# EAGLE design ee192 (EAGLE 7.0.0)
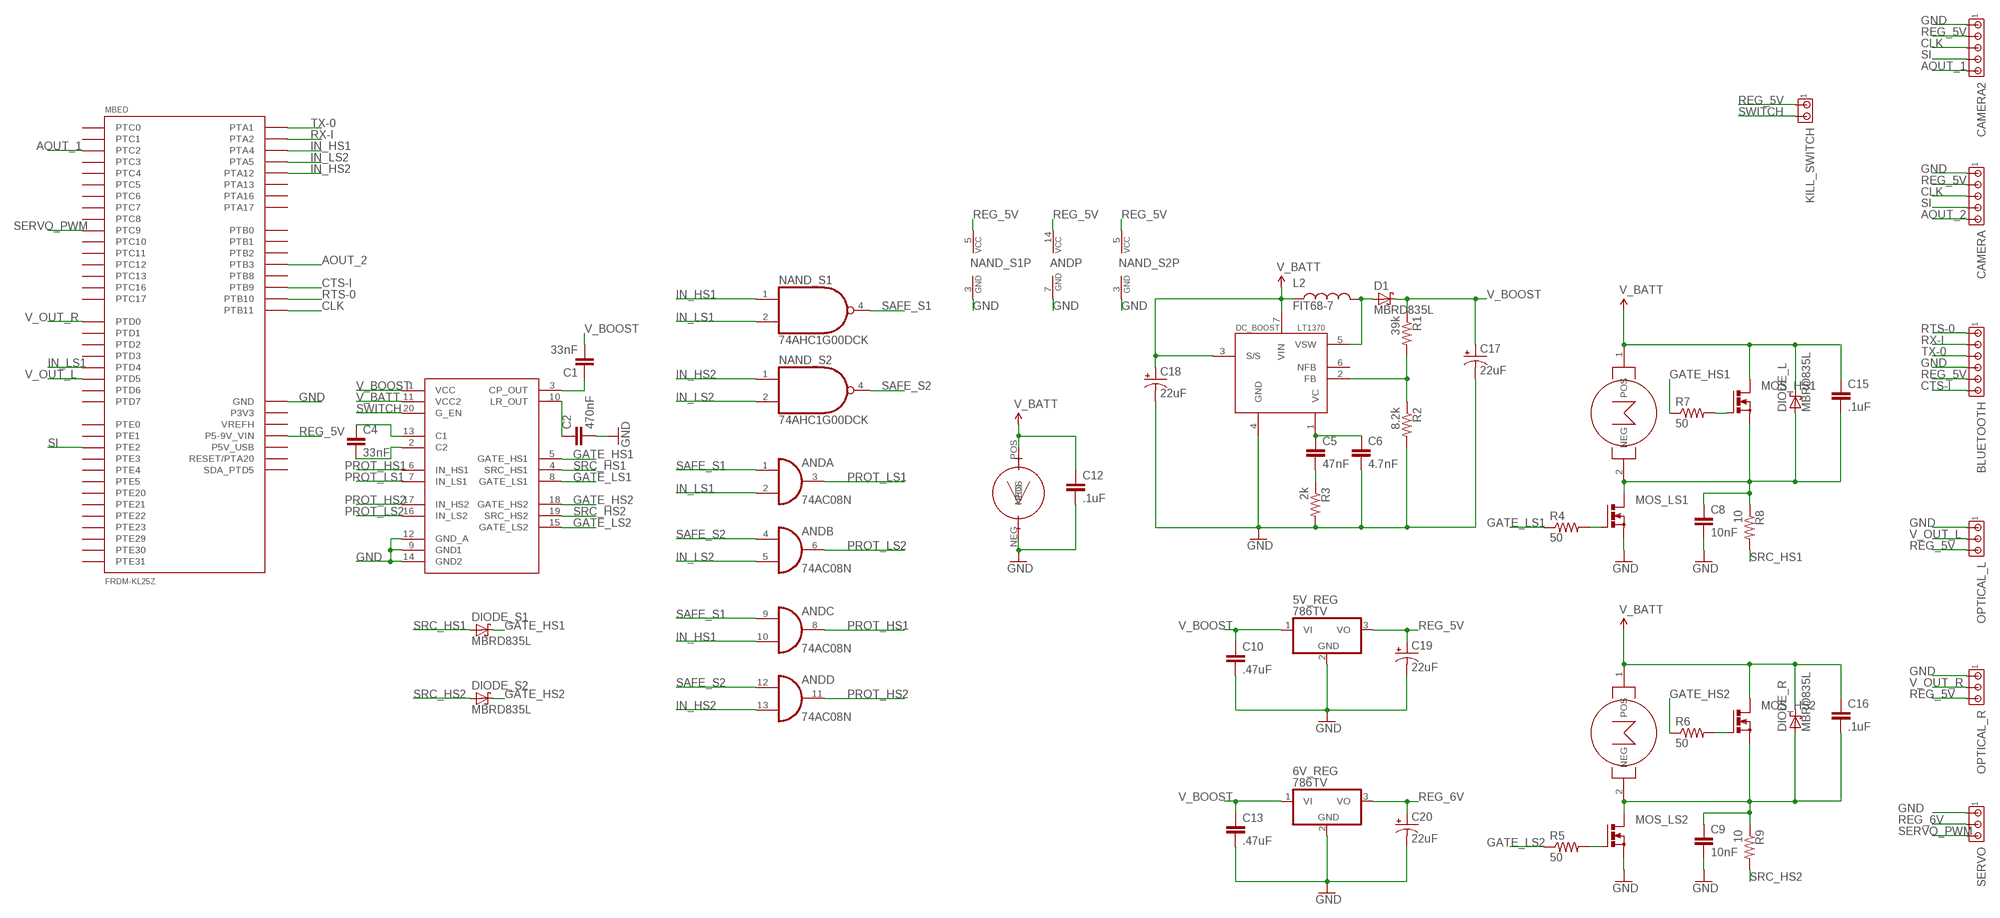
[diagram p0: schematic, sheet 1]

## Parts
5V_REG  786TV  [TO220V]
6V_REG  786TV  [TO220V]
AND  74AC08N  [DIL14]
BATTERY  BATT  [BATT]
BLUETOOTH  MTA06-100  [10X06MTA]
C1  33nF  CAP0805  [0805]
C2  470nF  CAP0805  [0805]
C4  33nF  CAP0805  [0805]
C5  47nF  CAP0805  [0805]
C6  4.7nF  CAP0805  [0805]
C8  10nF  CAP0805  [0805]
C9  10nF  CAP0805  [0805]
C10  .47uF  CAP0805  [0805]
C12  .1uF  CAP0805  [0805]
C13  .47uF  CAP0805  [0805]
C15  .1uF  CAP0805  [0805]
C16  .1uF  CAP0805  [0805]
C17  22uF  CAP_POL7343  [EIA7343]
C18  22uF  CAP_POL7343  [EIA7343]
C19  22uF  CAP_POL7343  [EIA7343]
C20  22uF  CAP_POL7343  [EIA7343]
CAMERA  MTA05-100  [10X05MTA]
CAMERA2  MTA05-100  [10X05MTA]
D1  MBRD835L  [DPAK]
DC_BOOST  LT1370  [TO220-7]
DIODE_L  MBRD835L  [DPAK]
DIODE_R  MBRD835L  [DPAK]
DIODE_S1  MBRD835L  [DPAK]
DIODE_S2  MBRD835L  [DPAK]
GATE_DRIVER  MC33883  [SO20W]
KILL_SWITCH  MTA02-100  [10X02MTA]
L2  FIT68-7  [FIT68-7]
MBED  FRDM-KL25Z  [FRDM-KL25Z]
MOS_HS1  PMOSFET_NTO220BV  [TO220BV]
MOS_HS2  PMOSFET_NTO220BV  [TO220BV]
MOS_LS1  PMOSFET_NTO220BV  [TO220BV]
MOS_LS2  PMOSFET_NTO220BV  [TO220BV]
MOTOR_L  MOTOR  [MOTOR]
MOTOR_R  MOTOR  [MOTOR]
NAND_S1  74AHC1G00DCK  [SC70-5]
NAND_S2  74AHC1G00DCK  [SC70-5]
OPTICAL_L  MTA03-100  [10X03MTA]
OPTICAL_R  MTA03-100  [10X03MTA]
R1  39k  RESISTOR0805-RES  [0805]
R2  8.2k  RESISTOR0805-RES  [0805]
R3  2k  RESISTOR0805-RES  [0805]
R4  50  RESISTOR0805-RES  [0805]
R5  50  RESISTOR0805-RES  [0805]
R6  50  RESISTOR0805-RES  [0805]
R7  50  RESISTOR0805-RES  [0805]
R8  10  RESISTOR0805-RES  [0805]
R9  10  RESISTOR0805-RES  [0805]
SERVO  MTA03-100  [10X03MTA]

## Nets
AOUT_1: CAMERA2.5 MBED.J10-10(PTC2)
AOUT_2: CAMERA.5 MBED.J10-8(PTB3)
CLK: CAMERA2.3 CAMERA.3 MBED.J9-7(PTB11)
CTS-I: BLUETOOTH.1 MBED.J9-3(PTB9)
GATE_HS1: DIODE_S1.P$3(C) GATE_DRIVER.5(GATE_HS1) R7.1
GATE_HS2: DIODE_S2.P$3(C) GATE_DRIVER.18(GATE_HS2) R6.1
GATE_LS1: GATE_DRIVER.8(GATE_LS1) R4.1
GATE_LS2: GATE_DRIVER.15(GATE_LS2) R5.1
GND: 5V_REG.2(GND) 6V_REG.2(GND) AND.7(P:GND) BATTERY.NEG BLUETOOTH.3 C2.2 C6.2 C8.2 C9.2 C10.2 C12.2 C13.2 C17.C(-) C18.C(-) C19.C(-) C20.C(-) CAMERA2.1 CAMERA.1 DC_BOOST.4(GND) GATE_DRIVER.9(GND1) GATE_DRIVER.12(GND_A) GATE_DRIVER.14(GND2) MBED.J2-14(GND) MBED.J9-12(GND) MBED.J9-14(GND) MOS_LS1.S MOS_LS2.S NAND_S1.3(GND) NAND_S2.3(GND) OPTICAL_L.1 OPTICAL_R.1 R2.2 R3.2 SERVO.1
IN_HS1: AND.10(C:I1) MBED.J1-10(PTA4) NAND_S1.1(I0)
IN_HS2: AND.13(D:I1) MBED.J1-8(PTA12) NAND_S2.1(I0)
IN_LS1: AND.2(A:I1) MBED.J1-6(PTD4) NAND_S1.2(I1)
IN_LS2: AND.5(B:I1) MBED.J1-12(PTA5) NAND_S2.2(I1)
L_NEG_MOTOR: C8.1 C15.2 DIODE_L.P$1(A) DIODE_L.P$2(A) MOS_HS1.S MOS_LS1.D MOTOR_L.2(NEG) R8.1
N$1: C2.1 GATE_DRIVER.10(LR_OUT)
N$2: C1.1 GATE_DRIVER.3(CP_OUT)
N$3: C4.1 GATE_DRIVER.13(C1)
N$4: C4.2 GATE_DRIVER.2(C2)
N$5: DC_BOOST.2(FB) R1.2 R2.1
N$7: MOS_HS2.G R6.2
N$9: MOS_LS1.G R4.2
N$10: MOS_LS2.G R5.2
N$12: MOS_HS1.G R7.2
N$15: C5.2 R3.1
N$16: C5.1 C6.1 DC_BOOST.1(VC)
PROT_HS1: AND.8(C:O) GATE_DRIVER.6(IN_HS1)
PROT_HS2: AND.11(D:O) GATE_DRIVER.17(IN_HS2)
PROT_LS1: AND.3(A:O) GATE_DRIVER.7(IN_LS1)
PROT_LS2: AND.6(B:O) GATE_DRIVER.16(IN_LS2)
R_NEG_MOTOR: C9.1 C16.2 DIODE_R.P$1(A) DIODE_R.P$2(A) MOS_HS2.S MOS_LS2.D MOTOR_R.2(NEG) R9.1
REG_5V: 5V_REG.3(VO) AND.14(P:VCC) BLUETOOTH.2 C19.A(+) CAMERA2.2 CAMERA.2 KILL_SWITCH.1 MBED.J9-16(P5-9V_VIN) NAND_S1.5(VCC) NAND_S2.5(VCC) OPTICAL_L.3 OPTICAL_R.3
REG_6V: 6V_REG.3(VO) C20.A(+) SERVO.2
RTS-0: BLUETOOTH.6 MBED.J9-5(PTB10)
RX-I: BLUETOOTH.5 MBED.J1-4(PTA2)
SAFE_S1: AND.1(A:I0) AND.9(C:I0) NAND_S1.4(O)
SAFE_S2: AND.4(B:I0) AND.12(D:I0) NAND_S2.4(O)
SERVO_PWM: MBED.J1-16(PTC9) SERVO.3
SI: CAMERA2.4 CAMERA.4 MBED.J9-9(PTE2)
SRC_HS1: DIODE_S1.P$1(A) DIODE_S1.P$2(A) GATE_DRIVER.4(SRC_HS1) R8.2
SRC_HS2: DIODE_S2.P$1(A) DIODE_S2.P$2(A) GATE_DRIVER.19(SRC_HS2) R9.2
SWITCH: GATE_DRIVER.20(G_EN) KILL_SWITCH.2
TX-0: BLUETOOTH.4 MBED.J1-2(PTA1)
V_BATT: BATTERY.POS C12.1 C15.1 C16.1 C18.A(+) DC_BOOST.3(S/S) DC_BOOST.7(VIN) DIODE_L.P$3(C) DIODE_R.P$3(C) GATE_DRIVER.11(VCC2) L2.P$1 MOS_HS1.D MOS_HS2.D MOTOR_L.1(POS) MOTOR_R.1(POS)
V_BOOST: 5V_REG.1(VI) 6V_REG.1(VI) C1.2 C10.1 C13.1 C17.A(+) D1.P$3(C) GATE_DRIVER.1(VCC) R1.1
V_OUT_L: MBED.J2-4(PTD5) OPTICAL_L.2
V_OUT_R: MBED.J2-6(PTD0) OPTICAL_R.2
VSW_LINE: D1.P$1(A) D1.P$2(A) DC_BOOST.5(VSW) L2.P$2
Unconnected: DC_BOOST.6(NFB) MBED.J1-1(PTC7) MBED.J1-3(PTC0) MBED.J1-5(PTC3) MBED.J1-7(PTC4) MBED.J1-9(PTC5) MBED.J1-11(PTC6) MBED.J1-13(PTC10) MBED.J1-14(PTC8) MBED.J1-15(PTC11) MBED.J2-1(PTC12) MBED.J2-2(PTA13) MBED.J2-3(PTC13) MBED.J2-5(PTC16) MBED.J2-7(PTC17) MBED.J2-8(PTD2) MBED.J2-9(PTA16) MBED.J2-10(PTD3) MBED.J2-11(PTA17) MBED.J2-12(PTD1) MBED.J2-13(PTE31) MBED.J2-16(VREFH) MBED.J2-17(PTD6) MBED.J2-18(PTE1) MBED.J2-19(PTD7) MBED.J2-20(PTE0) MBED.J9-1(PTB8) MBED.J9-2(SDA_PTD5) MBED.J9-4(P3V3) MBED.J9-6(RESET/PTA20) MBED.J9-8(P3V3) MBED.J9-10(P5V_USB) MBED.J9-11(PTE3) MBED.J9-13(PTE4) MBED.J9-15(PTE5) MBED.J10-1(PTE20) MBED.J10-2(PTB0) MBED.J10-3(PTE21) MBED.J10-4(PTB1) MBED.J10-5(PTE22) MBED.J10-6(PTB2) MBED.J10-7(PTE23) MBED.J10-9(PTE29) MBED.J10-11(PTE30) MBED.J10-12(PTC1)

## Library data of the parts
5V_REG 6V_REG = linear:78*: Positive VOLTAGE REGULATOR Source: http://cache.national.com/ds/LM/LM78L05.pdf http://www.fairchildsemi.com/ds/LM/LM7805.pdf
AND = 74xx-eu:74*08: Quad 2-input AND gate
BATTERY = natcar:BATT
BLUETOOTH = con-amp:MTA06-100: AMP connector
C1 C2 C4-C6 C8-C10 C12 C13 C15 C16 = SparkFun-Passives:CAP: Capacitor Standard 0603 ceramic capacitor, and 0.1" leaded capacitor.
C17-C20 = SparkFun-Capacitors:CAP_POL: Capacitor Polarized These are standard SMD and PTH capacitors. Normally 10uF, 47uF, and 100uF in electrolytic and tantalum varieties. Always verify the external diameter of the through hole cap, it varies with capacity, voltage, and manufacturer. The EIA devices should be standard.
CAMERA CAMERA2 = con-amp:MTA05-100: AMP connector
D1 DIODE_L DIODE_R DIODE_S1 DIODE_S2 = natcar:MBRD835L
DC_BOOST = ee192:LT1370: LT1370 Linear Technology 500kHz High Efficiency 6A Switching Regulator 7 Pin TO220 Package
GATE_DRIVER = ee192:MC33883
KILL_SWITCH = con-amp:MTA02-100: AMP connector
L2 = ee192:FIT68-7: FIT68-7 Switchmode/High Frequency Toroidal Inductor
MBED = ee192:FRDM-KL25Z: Shield for Freescale Freedom board FRDM-KL25Z 2012 by skot croshere 2013
MOS_HS1 MOS_HS2 MOS_LS1 MOS_LS2 = transistor-power:PMOSFET_N: Power MOSFET N-Channel
MOTOR_L MOTOR_R = natcar:MOTOR
NAND_S1 NAND_S2 = 74xx-little-us:74*1G00: 2-input NAND gate
OPTICAL_L OPTICAL_R SERVO = con-amp:MTA03-100: AMP connector
R1-R9 = SparkFun-Resistors:RESISTOR: Resistor Basic schematic elements and footprints for 0603, 1206, and PTH resistors.

## Board
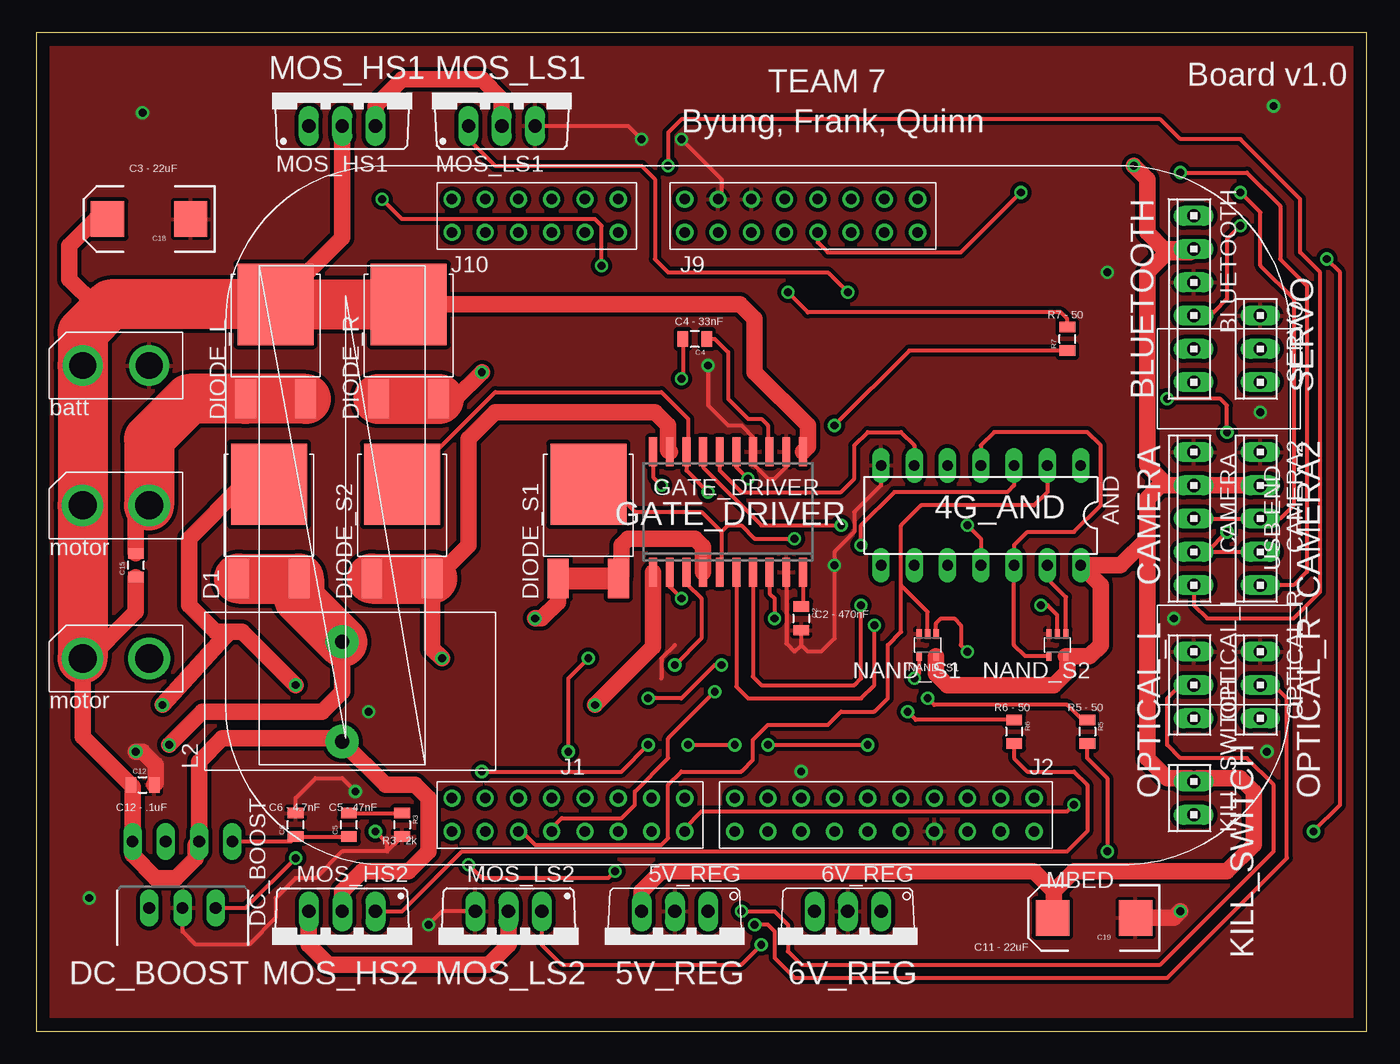
[diagram p1: board, top side]
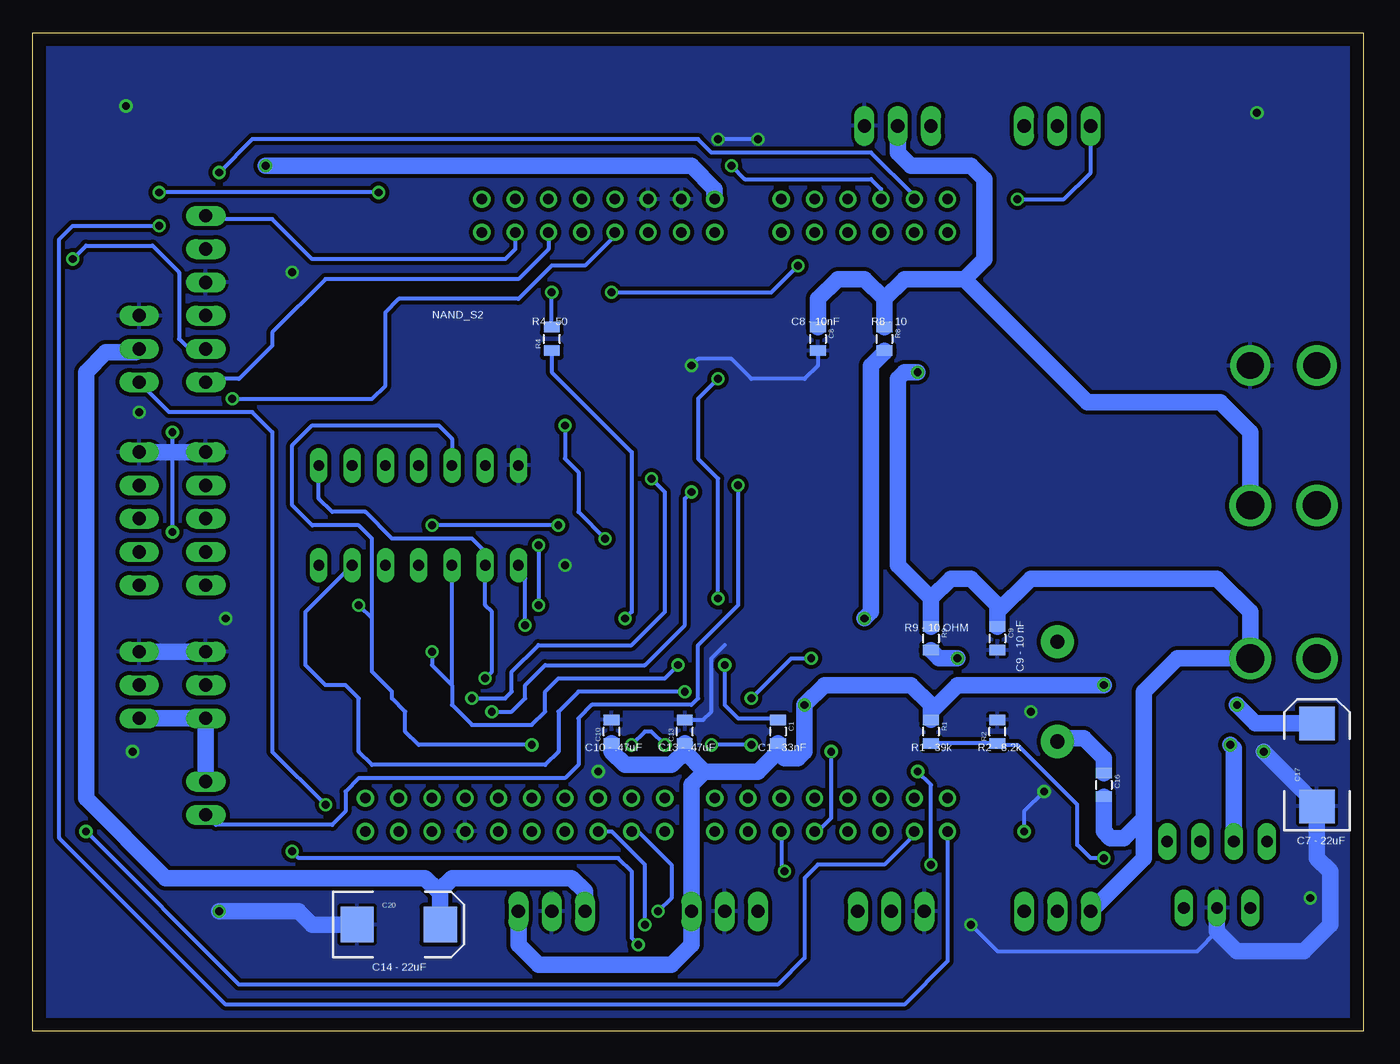
[diagram p2: board, bottom side, seen from below]

Size 101.6 x 76.2 mm. Coordinates in mm from the lower left corner, seen from the top.
Outline: 0,0 101.6,0 101.6,76.2 0,76.2 0,0
Copper layers (1*16): Top 0.035mm / dielectric 1.5mm / Bottom 0.035mm
Design rules "default *": minimum track width 15mil, minimum drill 24mil, track to track 8mil, track to pad 8mil, pad to pad 8mil, via to via 8mil, smd to smd 8mil, copper to edge 40mil, drill to drill 8mil, minimum pad ring 10mil, minimum via ring 8mil, stop-mask expansion 4mil, vias tented up to drill 0mil, thermal gap 10mil

### Footprints (pad centres in the part's own frame; a part is rotated, then mirrored left to right if it is on the bottom)
TO220V = drill 1.016 long: 1 -2.54,-2.54; 2 0,-2.54; 3 2.54,-2.54
DIL14 = drill 0.813 long: 1 -7.62,-3.81; 2 -5.08,-3.81; 3 -2.54,-3.81; 4 0,-3.81; 5 2.54,-3.81; 6 5.08,-3.81; 7 7.62,-3.81; 8 7.62,3.81; 9 5.08,3.81; 10 2.54,3.81; 11 0,3.81; 12 -2.54,3.81; 13 -5.08,3.81; 14 -7.62,3.81
BATT = drill 2.052: NEG -2.54,0; POS -7.62,0
10X06MTA = drill 1.016 long: 1 6.35,0; 2 3.81,0; 3 1.27,0; 4 -1.27,0; 5 -3.81,0; 6 -6.35,0
0805 = smd 0.8 x 1.2: 1 -0.9,0; 2 0.9,0
EIA7343 = smd 2.55 x 2.7: A 3.17,0; C -3.17,0
10X05MTA = drill 1.016 long: 1 5.08,0; 2 2.54,0; 3 0,0; 4 -2.54,0; 5 -5.08,0
DPAK = smd 1.6 x 3: P$1 -2.3,0; P$2 2.3,0 | smd 5.8 x 6.2: P$3 0,7.2
TO220-7 = drill 0.9 long: 1 -3.81,-3.81; 2 -2.54,1.27; 3 -1.27,-3.81; 4 0,1.27; 5 1.27,-3.81; 6 2.54,1.27; 7 3.81,-3.81
SO20W = smd 0.6 x 2.2: 1 -5.715,-4.6; 2 -4.445,-4.6; 3 -3.175,-4.6; 4 -1.905,-4.6; 5 -0.635,-4.6; 6 0.635,-4.6; 7 1.905,-4.6; 8 3.175,-4.6; 9 4.445,-4.6; 10 5.715,-4.6; 11 5.715,4.6; 12 4.445,4.6; 13 3.175,4.6; 14 1.905,4.6; 15 0.635,4.6; 16 -0.635,4.6; 17 -1.905,4.6; 18 -3.175,4.6; 19 -4.445,4.6; 20 -5.715,4.6
10X02MTA = drill 1.016 long: 1 1.27,0; 2 -1.27,0
FIT68-7 = drill 1.1 pad 2.54: P$1 -3.81,0; P$2 3.81,0
FRDM-KL25Z = drill 0.8: J1-1 23.622,21.59; J1-2 23.622,24.13; J1-3 21.082,21.59; J1-4 21.082,24.13; J1-5 18.542,21.59; J1-6 18.542,24.13; J1-7 16.002,21.59; J1-8 16.002,24.13; J1-9 13.462,21.59; J1-10 13.462,24.13; J1-11 10.922,21.59; J1-12 10.922,24.13; J1-13 8.382,21.59; J1-14 8.382,24.13; J1-15 5.842,21.59; J1-16 5.842,24.13; J2-1 2.032,21.59; J2-2 2.032,24.13; J2-3 -0.508,21.59; J2-4 -0.508,24.13; J2-5 -3.048,21.59; J2-6 -3.048,24.13; J2-7 -5.588,21.59; J2-8 -5.588,24.13; J2-9 -8.128,21.59; J2-10 -8.128,24.13; J2-11 -10.668,21.59; J2-12 -10.668,24.13; J2-13 -13.208,21.59; J2-14 -13.208,24.13; J2-15 -15.748,21.59; J2-16 -15.748,24.13; J2-17 -18.288,21.59; J2-18 -18.288,24.13; J2-19 -20.828,21.59; J2-20 -20.828,24.13; J9-1 -11.938,-21.59; J9-2 -11.938,-24.13; J9-3 -9.398,-21.59; J9-4 -9.398,-24.13; J9-5 -6.858,-21.59; J9-6 -6.858,-24.13; J9-7 -4.318,-21.59; J9-8 -4.318,-24.13; J9-9 -1.778,-21.59; J9-10 -1.778,-24.13; J9-11 0.762,-21.59; J9-12 0.762,-24.13; J9-13 3.302,-21.59; J9-14 3.302,-24.13; J9-15 5.842,-21.59; J9-16 5.842,-24.13; J10-1 10.922,-21.59; J10-2 10.922,-24.13; J10-3 13.462,-21.59; J10-4 13.462,-24.13; J10-5 16.002,-21.59; J10-6 16.002,-24.13; J10-7 18.542,-21.59; J10-8 18.542,-24.13; J10-9 21.082,-21.59; J10-10 21.082,-24.13; J10-11 23.622,-21.59; J10-12 23.622,-24.13
TO220BV = drill 1.016 long: D 0,-2.54; G -2.54,-2.54; S 2.54,-2.54
MOTOR = drill 2.159: 1 -7.62,0; 2 -2.54,0
SC70-5 = smd 0.4 x 0.7: 1 -0.65,-0.85; 2 0,-0.85; 3 0.65,-0.85; 4 0.65,0.85; 5 -0.65,0.85
10X03MTA = drill 1.016 long: 1 2.54,0; 2 0,0; 3 -2.54,0

### Placement (x,y rotation side)
5V_REG  48.77,6.6 180 top
6V_REG  61.98,6.6 180 top
AND  72.14,39.37 180 top
BATTERY  11.18,50.8 0 top
BLUETOOTH  88.39,55.88 90 top
C1  44.7,22.86 270 bottom
C2  58.42,31.5 270 top
C4  50.29,52.83 180 top
C5  23.88,15.75 90 top
C6  19.81,15.75 90 top
C8  41.66,52.83 270 bottom
C9  27.94,29.97 270 bottom
C10  57.4,22.86 90 bottom
C12  8.13,18.8 0 top
C13  51.82,22.86 90 bottom
C15  7.62,35.56 90 top
C16  19.81,18.8 270 bottom
C17  3.56,20.32 90 bottom
C18  8.64,61.98 180 top
C19  80.77,8.64 180 top
C20  73.66,8.13 0 bottom
CAMERA  88.39,39.12 90 top
CAMERA2  93.47,39.12 90 top
D1  17.78,34.54 0 top
DC_BOOST  11.18,10.67 180 top
DIODE_L  18.29,48.26 0 top
DIODE_R  28.45,48.26 0 top
DIODE_S1  42.16,34.54 0 top
DIODE_S2  27.94,34.54 0 top
GATE_DRIVER  52.83,39.62 0 top
KILL_SWITCH  88.39,17.78 90 top
L2  23.37,25.91 90 top
MBED  55.37,39.37 180 top
MOS_HS1  23.37,71.63 0 top
MOS_HS2  23.37,6.6 180 top
MOS_LS1  35.56,71.63 0 top
MOS_LS2  36.07,6.6 180 top
MOTOR_L  11.18,40.13 0 top
MOTOR_R  11.18,28.45 0 top
NAND_S1  68.07,29.46 180 top
NAND_S2  77.98,29.46 180 top
OPTICAL_L  88.39,26.42 90 top
OPTICAL_R  93.47,26.42 90 top
R1  33.02,22.86 270 bottom
R2  27.94,22.86 90 bottom
R3  27.94,15.75 270 top
R4  61.98,52.83 90 bottom
R5  80.26,22.86 270 top
R6  74.68,22.86 270 top
R7  78.74,52.83 90 top
R8  36.58,52.83 270 bottom
R9  33.02,29.97 270 bottom
SERVO  93.47,52.07 90 top

### Tracks (layer width: path | path; a pad name or v marks a point on that pad's centre or on a via)
AOUT_1  (via drill 0.6)
  Top 0.305: CAMERA2.5 96.01,34.04 97.03,35.05 97.03,56.9 95,58.93 95,62.99 92.46,65.53 v87.38,65.53
  Bottom 0.305: MBED.J10-10 34.29,63.75 37.59,67.06 49.78,67.06 50.8,68.07 84.84,68.07 v87.38,65.53
AOUT_2  (via drill 0.6)
  Top 0.305: CAMERA.5 88.39,32.51 89.41,31.5 96.01,31.5 98.04,33.53 98.04,57.91 96.52,59.44 96.52,63.5 91.95,68.07 87.38,68.07 85.85,69.6 49.28,69.6 48.26,68.58 v48.26,66.04
  Bottom 0.305: v48.26,66.04 47.24,65.02 37.59,65.02 36.83,64.26 MBED.J10-8
CLK  (via drill 0.6)
  Top 0.305: CAMERA.3 CAMERA2.3 95,39.12 96.01,40.13 96.01,55.88 93.47,58.42 93.47,62.48 v91.95,64.01 | MBED.J9-7 59.69,60.2 60.45,59.44 70.61,59.44 v75.18,64.01
  Bottom 0.305: v75.18,64.01 v91.95,64.01
CTS-I
  Bottom 0.305: MBED.J9-3 64.77,59.69 65.53,58.93 80.26,58.93 83.31,61.98 88.14,61.98 BLUETOOTH.1
GATE_HS1  (via drill 0.6)
  Top 0.305: DIODE_S1.P$3 43.6,41.74 45.72,39.62 50.8,39.62 52.32,38.1 | 52.32,38.1 52.32,35.15 GATE_DRIVER.5 | 52.32,38.1 52.83,38.61 53.85,38.61 54.86,37.59 v57.91,37.59 | R7.1 66.66,51.93 v60.96,46.23
  Bottom 0.305: v60.96,46.23 60.96,43.69 59.94,42.67 59.94,39.62 v57.91,37.59
GATE_HS2  (via drill 0.6)
  Top 0.305: DIODE_S2.P$3 28.03,41.74 35.05,48.77 47.75,48.77 49.78,46.74 49.78,44.35 GATE_DRIVER.18 49.66,42.8 v51.31,41.15 | R6.1 67.17,23.76 v66.55,24.38
  Bottom 0.305: v66.55,24.38 65.02,24.38 64.01,25.4 64.01,26.42 62.48,27.94 54.86,27.94 51.82,30.99 51.82,40.64 v51.31,41.15
GATE_LS1  (via drill 0.6)
  Top 0.305: GATE_DRIVER.8 56.01,33.4 56.39,33.02 v56.39,31.5
  Bottom 0.305: R4.1 61.98,50.29 55.88,44.2 55.88,32 v56.39,31.5
GATE_LS2  (via drill 0.6)
  Top 0.305: R5.1 79.87,23.76 78.74,24.89 68.58,24.89 v68.07,25.4 | GATE_DRIVER.15 53.47,43.05 v54.36,42.16
  Bottom 0.305: v68.07,25.4 65.53,25.4 65.02,25.91 65.02,27.43 62.99,29.46 55.88,29.46 53.34,32 53.34,41.15 v54.36,42.16
GND  (via drill 0.6)
  Top 0.305: 26.81,13.72 23.37,13.72 21.34,11.68 19.81,11.68 18.29,10.16 18.29,8.64 16.26,6.6 12.19,6.6 11.18,7.62 DC_BOOST.4 | MOS_LS2.S 30.99,9.14 v29.97,8.13 | C6.2 19.81,17.78 21.34,19.3 23.37,19.3 v24.38,18.29 | 26.81,13.72 R3.2 | 26.81,13.72 26.81,14.34 25.91,15.24 | MOS_LS1.S 45.21,69.09 v46.23,68.07 | v49.28,68.07 52.32,65.02 52.32,63.75 MBED.J9-14 | v51.31,50.8 51.31,47.75 52.83,46.23 53.85,46.23 54.86,45.21 54.86,44.35 GATE_DRIVER.14 54.74,43.81 54.86,43.69 54.86,43.18 55.88,42.16 56.39,42.16 57.4,43.18 57.4,44.1 GATE_DRIVER.12 | AND.7 64.52,41.66 62.48,39.62 62.48,38.1 60.96,36.58 v60.96,35.56 60.96,29.97 59.94,28.96 58.93,28.96 58.42,29.46 | 58.42,29.46 C2.2 | GATE_DRIVER.9 57.28,29.59 57.91,28.96 58.42,29.46 | 48.77,29.46 47.75,28.45 47.75,26.92
  Top 1.27: v7.62,21.34 8.13,21.34 9.14,20.32 9.14,18.91 C12.2 | C19.C 86.87,8.64 v87.38,9.14
  Bottom 0.305: v29.97,8.13 27.94,6.1 12.7,6.1 11.18,7.62 | v24.38,18.29 25.91,16.76 25.91,15.24 | v46.23,68.07 v49.28,68.07 | C8.2 41.66,50.8 42.67,49.78 46.74,49.78 48.26,51.31 50.8,51.31 v51.31,50.8 | C13.2 50.41,23.76 49.78,24.38 49.78,28.45 48.77,29.46
  Bottom 1.27: v7.62,21.34 3.56,17.27 C17.C 3.56,13.21 2.54,12.19 2.54,8.13 4.57,6.1 9.65,6.1 11.18,7.62 DC_BOOST.4 | v87.38,9.14 81.28,9.14 80.26,8.13 C20.C | OPTICAL_L.1 OPTICAL_R.1 | CAMERA.1 CAMERA2.1
  other vias: 93.98,21.34 94.49,70.61 8.13,70.1 4.06,10.16 86.87,31.5 93.47,47.24 81.79,57.91 25.4,24.38 58.42,19.81
  pour Bottom (isolate 0.305): -0.51,76.71 101.6,76.71 104.65,73.66 104.65,0 104.14,-0.51 -3.56,-0.51 -7.11,-4.06 -7.11,69.09 0,76.2
  pour Top (isolate 0.305): -7.62,81.79 121.92,81.79 125.98,77.72 125.98,-16.26 119.38,-22.86 -10.67,-22.86
IN_HS1  (via drill 0.6)
  Top 0.305: v40.64,21.34 40.64,26.92 v42.16,28.45 | NAND_S1.1 68.72,31.13 69.09,31.5 70.1,31.5 70.61,30.99 70.61,29.46 v71.12,28.96 | v52.32,27.94 51.82,27.94 49.28,25.4 v46.74,25.4
  Bottom 0.305: MBED.J1-10 41.66,15.24 40.64,16.26 v40.64,21.34 | v46.74,25.4 43.69,28.45 v42.16,28.45 | 69.6,26.42 AND.10 | v71.12,28.96 71.12,27.94 69.6,26.42 | 69.6,26.42 69.6,24.89 68.07,23.37 63.5,23.37 62.48,24.38 62.48,25.91 61.47,26.92 53.34,26.92 v52.32,27.94
IN_HS2  (via drill 0.6)
  Top 0.305: MBED.J1-8 39.37,15.49 40.13,16.26 44.7,16.26 45.72,17.27 45.72,18.29 48.26,20.83 48.26,22.35 v51.82,25.91 | NAND_S2.1 78.63,33.13 77.22,34.54 AND.13
  Bottom 0.305: v51.82,25.91 59.94,25.91 61.47,24.38 61.47,21.34 62.48,20.32 75.69,20.32 76.71,21.34 76.71,25.4 77.72,26.42 79.25,26.42 80.77,27.94 80.77,32 AND.13
IN_LS1
  Top 0.305: MBED.J1-6 37.08,15.24 38.1,14.22 47.75,14.22 48.26,14.73 48.26,18.8 49.28,19.81 53.85,19.81 54.74,20.7 54.74,22.23 55.88,23.37 60.45,23.37 61.47,24.38 64.01,24.38 65.02,25.4 65.02,29.46 66.04,30.48 66.04,34.04 | AND.2 77.22,41.15 76.2,40.13 67.56,40.13 66.04,38.61 66.04,34.04 | NAND_S1.2 68.07,32 66.04,34.04
IN_LS2  (via drill 0.6)
  Top 0.305: v44.2,12.19 43.69,11.68 34.04,11.68 v33.02,12.7 | v34.04,19.81 44.7,19.81 v46.74,21.84 | v49.78,21.84 v53.34,21.84 | v55.88,21.84 v63.5,21.84 | NAND_S2.2 77.98,31.75 77.22,32.51 v76.71,32.51
  Bottom 0.305: MBED.J1-12 44.45,12.45 v44.2,12.19 | v33.02,12.7 33.02,18.8 v34.04,19.81 | v46.74,21.84 v49.78,21.84 | v53.34,21.84 54.36,22.86 54.86,22.86 v55.88,21.84 | v63.5,21.84 72.14,21.84 73.15,22.86 73.15,24.38 74.17,25.4 74.17,25.91 75.69,27.43 75.69,31.5 | 75.69,31.5 75.69,37.59 76.71,38.61 80.26,38.61 81.79,40.13 81.79,44.7 80.26,46.23 70.61,46.23 69.6,45.21 AND.5 | v76.71,32.51 75.69,31.5
L_NEG_MOTOR
  Top 1.27: MOS_HS1.S 25.91,70.61 27.94,72.64 34.04,72.64 35.56,71.12 MOS_LS1.D | C15.2 7.62,39.12 MOTOR_L.2
  Top 3.81: DIODE_L.P$2 DIODE_L.P$1 11.68,48.26 8.64,45.21 MOTOR_L.2
  Bottom 1.27: MOS_LS1.D 35.56,67.06 34.54,66.04 29.97,66.04 28.96,65.02 28.96,58.93 30.48,57.4 | 30.48,57.4 35.05,57.4 36.58,55.88 | R8.1 36.58,55.88 | 36.58,55.88 38.1,57.4 40.13,57.4 41.66,55.88 C8.1 | MOTOR_L.2 8.64,45.72 10.92,48.01 21.08,48.01 30.48,57.4
N$1
  Top 0.305: GATE_DRIVER.10 58.55,32.52 C2.1
N$2  (via drill 0.6)
  Top 0.305: GATE_DRIVER.3 49.66,34.16 50.8,33.02 50.8,29.97 v48.77,27.94
  Bottom 0.305: v48.77,27.94 48.77,24.89 47.75,23.88 44.82,23.88 C1.1
N$3
  Top 0.305: C4.1 51.82,52.83 52.83,51.82 52.83,48.26 54.36,46.74 55.37,46.74 55.88,46.23 55.88,44.35 GATE_DRIVER.13
N$4  (via drill 0.6)
  Top 0.305: GATE_DRIVER.2 48.39,33.91 v49.28,33.02 | C4.2 49.39,49.9 v49.28,49.78
  Bottom 0.305: v49.28,33.02 49.28,42.16 50.8,43.69 50.8,48.26 v49.28,49.78
N$5  (via drill 0.6)
  Top 0.305: DC_BOOST.2 16,9.4 v19.81,13.21
  Bottom 0.305: R1.2 R2.1 27.82,21.84 26.42,21.84 21.84,17.27 21.84,14.22 20.83,13.21 v19.81,13.21
N$7
  Top 0.305: MOS_HS2.G 27.94,9.14 32.51,13.72 78.74,13.72 80.26,15.24 80.26,18.8 79.25,19.81 75.69,19.81 74.68,20.83 R6.2
N$9  (via drill 0.6)
  Top 0.305: MOS_LS1.G 33.02,68.07 35.05,66.04 46.23,66.04 47.24,65.02 47.24,58.93 48.26,57.91 60.45,57.91 v61.98,56.39
  Bottom 0.305: R4.2 v61.98,56.39
N$10  (via drill 0.6)
  Top 0.305: MOS_LS2.G 38.61,6.6 40.13,5.08 53.85,5.08 v55.37,6.6 | R5.2 80.26,20.83 81.79,19.3 v81.79,13.72
  Bottom 0.305: v81.79,13.72 81.28,13.21 56.9,13.21 55.88,12.19 55.88,7.11 v55.37,6.6
N$12  (via drill 0.6)
  Top 0.305: R7.2 78.74,54.36 78.23,54.86 58.93,54.86 v57.4,56.39 | v43.18,58.42 43.18,61.47 42.67,61.98 27.94,61.98 v26.42,63.5
  Bottom 0.305: v57.4,56.39 45.21,56.39 v43.18,58.42 | v26.42,63.5 22.86,63.5 20.83,65.53 MOS_HS1.G
N$15
  Top 0.305: C5.2 R3.1
N$16
  Top 0.305: DC_BOOST.1 19.44,14.48 C6.1 C5.1
N$21  (via drill 0.6)
  other vias: 25.91,15.24
PROT_HS1  (via drill 0.6)
  Top 0.305: GATE_DRIVER.6 53.47,26.29 54.36,25.4 62.99,25.4 64.01,26.42 v64.01,30.99
  Bottom 0.305: AND.8 64.52,35.05 64.01,34.54 v64.01,30.99
PROT_HS2  (via drill 0.6)
  Top 0.305: GATE_DRIVER.17 50.93,43.05 55.37,38.61 v61.47,38.61 | v71.12,38.61 72.14,37.59 AND.11
  Bottom 0.305: v61.47,38.61 v71.12,38.61
PROT_LS1  (via drill 0.6)
  Top 0.305: GATE_DRIVER.7 54.74,27.05 55.37,26.42 62.48,26.42 62.99,26.92 v62.99,32.51 | v62.99,37.08 62.99,38.61 65.53,41.15 74.17,41.15 74.68,41.66 AND.3
  Bottom 0.305: v62.99,37.08 v62.99,32.51
PROT_LS2
  Top 0.305: GATE_DRIVER.16 52.2,42.8 53.85,41.15 61.47,41.15 62.48,42.16 62.48,44.7 63.5,45.72 66.04,45.72 67.06,44.7 AND.6
R_NEG_MOTOR  (via drill 0.6)
  Top 1.27: MOS_HS2.S 20.83,6.6 22.35,5.08 34.54,5.08 36.07,6.6 MOS_LS2.D | DIODE_R.P$2 32,48.26 v34.04,50.29
  Top 3.81: DIODE_R.P$1 DIODE_R.P$2
  Bottom 1.27: R9.1 33.02,33.02 | 33.02,33.02 31.5,34.54 29.97,34.54 27.94,32.51 C9.1 27.94,32 25.4,34.54 11.18,34.54 8.64,32 MOTOR_R.2 14.22,28.45 16.76,25.91 16.76,16.26 | 16.76,16.26 16.76,13.21 MOS_HS2.S | v34.04,50.29 35.05,50.29 35.56,49.78 35.56,35.56 33.02,33.02 | C16.2 19.81,15.24 19.3,14.73 18.29,14.73 16.76,16.26
REG_5V  (via drill 0.6)
  Top 1.27: 5V_REG.3 46.23,10.67 47.75,12.19 76.2,12.19 77.72,10.67 | CAMERA2.2 CAMERA.2 | CAMERA.2 85.85,41.66 84.84,40.64 84.84,37.59 | 84.84,37.59 84.84,20.83 86.36,19.3 88.14,19.3 KILL_SWITCH.1 88.65,19.3 91.95,19.3 92.96,18.29 92.96,14.22 90.93,12.19 79.25,12.19 77.72,10.67 | CAMERA.2 86.36,41.66 84.84,43.18 84.84,57.91 86.36,59.44 88.14,59.44 BLUETOOTH.2 86.11,59.69 84.84,60.96 84.84,65.02 v83.82,66.04 | 84.84,37.59 82.8,35.56 AND.14 81.28,34.04 81.28,29.46 80.43,28.61 NAND_S2.5 78.74,28.5 78.74,27.43 77.72,26.42 69.6,26.42 68.72,27.29 NAND_S1.5 | 77.72,10.67 77.72,8.76 C19.A
  Bottom 1.27: OPTICAL_R.3 OPTICAL_L.3 KILL_SWITCH.1 | v83.82,66.04 51.31,66.04 49.53,64.26 MBED.J9-16
REG_6V
  Bottom 1.27: 6V_REG.3 59.44,10.67 60.45,11.68 69.6,11.68 70.49,10.79 | SERVO.2 93.73,51.82 96.01,51.82 97.54,50.29 97.54,17.78 91.44,11.68 71.63,11.68 70.73,10.79 70.49,10.79 | C20.A 70.49,10.79
RTS-0
  Bottom 0.305: MBED.J9-5 62.23,59.69 64.52,57.4 79.25,57.4 83.31,53.34 83.31,52.32 85.85,49.78 88.14,49.78 BLUETOOTH.6
RX-I  (via drill 0.6)
  Top 0.305: v97.54,15.24 99.57,17.27 99.57,57.91 v98.55,58.93
  Bottom 0.305: MBED.J1-4 34.29,14.99 36.58,12.7 41.66,12.7 42.67,11.68 42.67,5.59 44.7,3.56 85.85,3.56 v97.54,15.24 | v98.55,58.93 97.54,59.94 92.46,59.94 90.42,57.91 90.42,52.83 89.66,52.07 BLUETOOTH.5
SAFE_S1  (via drill 0.6)
  Top 0.305: NAND_S1.4 67.42,27.29 v67.06,26.92
  Bottom 0.305: AND.1 79.76,40.64 78.74,39.62 76.2,39.62 74.17,37.59 68.07,37.59 67.06,36.58 AND.9 67.06,32.51 66.55,32 66.55,27.43 v67.06,26.92
SAFE_S2
  Top 0.305: NAND_S2.4 75.53,28.61 74.68,29.46 AND.12 74.68,37.08 75.69,38.1 79.25,38.1 81.28,40.13 81.28,44.7 80.26,45.72 73.15,45.72 72.14,44.7 AND.4
SERVO_PWM  (via drill 0.6)
  Top 0.305: MBED.J1-16 49.53,15.49 50.8,16.76 78.74,16.76 v79.25,17.27
  Bottom 0.305: v79.25,17.27 83.31,21.34 83.31,45.72 84.84,47.24 91.19,47.24 SERVO.3
SI  (via drill 0.6)
  Top 0.305: CAMERA2.4 CAMERA.4 89.41,36.58 v90.93,38.1 | v90.93,45.72 90.93,47.75 90.42,48.26 v86.36,48.26
  Bottom 0.305: v90.93,38.1 v90.93,45.72 | v86.36,48.26 75.69,48.26 74.68,49.28 74.68,54.86 73.66,55.88 64.52,55.88 61.98,58.42 59.44,58.42 57.15,60.71 MBED.J9-9
SRC_HS1  (via drill 0.6)
  Top 1.27: v38.1,31.5 38.61,31.5 39.86,32.75 DIODE_S1.P$1 40.13,34.54 | GATE_DRIVER.4 50.93,36.96 50.29,37.59 45.21,37.59 44.7,37.08 44.7,34.78 DIODE_S1.P$2
  Top 1.676: DIODE_S1.P$2 40.13,34.54
  Bottom 1.27: R8.2 36.58,51.82 37.59,50.8 37.59,32 v38.1,31.5
SRC_HS2  (via drill 0.6)
  Top 1.27: v30.99,28.45 30.24,29.2 DIODE_S2.P$2 30.48,34.54 33.02,37.08 33.02,45.21 35.05,47.24 47.24,47.24 48.26,46.23 48.26,44.35 GATE_DRIVER.19
  Top 3.81: DIODE_S2.P$1 DIODE_S2.P$2
  Bottom 1.27: v30.99,28.45 32.4,28.45 R9.2
SWITCH  (via drill 0.6)
  Top 0.305: GATE_DRIVER.20 47.12,42.29 v47.75,41.66
  Bottom 0.305: v47.75,41.66 47.75,32.51 50.8,29.46 50.8,25.4 51.31,24.89 58.93,24.89 59.94,23.88 59.94,20.32 60.96,19.3 76.71,19.3 77.72,18.29 77.72,16.76 78.74,15.75 87.63,15.75 KILL_SWITCH.2
TX-0  (via drill 0.6)
  Top 0.305: v91.95,61.47 90.93,60.45 90.93,55.88 89.92,54.86 88.65,54.86 BLUETOOTH.4
  Bottom 0.305: MBED.J1-2 31.75,5.33 35.05,2.03 86.87,2.03 99.57,14.73 99.57,60.45 98.55,61.47 v91.95,61.47
V_BATT
  Top 1.27: MOTOR_R.1 3.56,27.94 | 3.56,27.94 3.56,22.47 C12.1 7.37,18.66 DC_BOOST.7 7.37,13.46 9.14,11.68 10.67,11.68 12.19,13.21 12.19,14.22 DC_BOOST.3 12.45,20.57 14.22,22.35 23.11,22.35 L2.P$1 26.67,18.8 28.96,18.8 29.97,17.78 29.97,13.72 28.45,12.19 24.89,12.19 23.37,10.67 MOS_HS2.D | DIODE_R.P$3 53.76,55.46 54.86,54.36 54.86,50.29 58.93,46.23 58.93,44.6 GATE_DRIVER.11 | MOS_HS1.D 23.37,60.54 DIODE_L.P$3 | C15.1 7.62,32 3.56,27.94 | C18.A 4.57,61.98 2.54,59.94 2.54,57.4 4.48,55.46 5.68,55.46
  Top 3.81: MOTOR_R.1 MOTOR_L.1 BATTERY.POS 3.56,53.34 5.68,55.46 DIODE_L.P$3 DIODE_R.P$3
  Bottom 1.27: C16.1 19.81,20.83 21.34,22.35 23.11,22.35 L2.P$1
V_BOOST  (via drill 0.6)
  Top 1.27: v19.81,26.42 15.75,30.48 14.73,30.48 | 14.73,30.48 13.72,30.48 11.68,32.51 11.68,37.59 15.75,41.66 17.69,41.66 D1.P$3 | GATE_DRIVER.1 47.12,29.34 v42.67,24.89 | v9.65,24.89 14.73,30.48
  Bottom 1.27: v19.81,26.42 30.99,26.42 33.02,24.38 R1.1 33.02,24.89 34.54,26.42 41.15,26.42 v42.67,24.89 42.67,21.34 43.18,20.83 44.2,20.83 44.7,21.34 | C1.2 44.7,21.34 | 50.29,19.81 51.31,18.8 5V_REG.1 51.31,6.6 52.83,5.08 62.99,5.08 64.52,6.6 6V_REG.1 | 50.29,19.81 46.23,19.81 44.7,21.34 | 51.82,21.34 50.29,19.81 | C13.1 51.82,21.34 | 51.82,21.34 52.83,20.32 56.39,20.32 57.4,21.34 C10.1 | C17.A 8.25,23.49 v9.65,24.89
V_OUT_L  (via drill 0.6)
  Top 0.305: OPTICAL_L.2 87.38,26.42 86.36,25.4 86.36,21.84 87.38,20.83 92.46,20.83 94.49,18.8 94.49,13.72 85.85,5.08 58.42,5.08 57.4,6.1 57.4,8.13 56.39,9.14 v53.85,9.14
  Bottom 0.305: MBED.J2-4 55.37,15.24 52.83,12.7 52.83,10.16 v53.85,9.14
V_OUT_R  (via drill 0.6)
  Top 0.305: OPTICAL_R.2 94.49,26.42 95.5,25.4 95.5,13.21 86.36,4.06 57.91,4.06 56.39,5.59 56.39,7.62 55.88,8.13 v54.86,8.13
  Bottom 0.305: MBED.J2-6 57.4,15.24 54.86,12.7 v54.86,8.13
VSW_LINE  (via drill 0.6)
  Top 1.27: v10.16,21.84 12.7,24.38 21.84,24.38 23.37,25.91 L2.P$2
  Top 3.81: D1.P$1 D1.P$2 20.08,33.01 L2.P$2
  Bottom 1.27: DC_BOOST.5 9.91,21.59 v10.16,21.84

### Text on the board
tPlace: MOS_HS1 | MOS_LS1 | TEAM 7 | Board v1.0 | Byung, Frank, Quinn | C3 - 22uF | C4 - 33nF | R7 - 50 | SERVO | BLUETOOTH | GATE_DRIVER | 4G_AND | CAMERA | CAMERA2 | C2 - 470nF | NAND_S1 | R6 - 50 | R5 - 50 | OPTICAL_L | OPTICAL_R | C12 - .1uF | C6 - 4.7nF | C5 - 47nF | R3 - 2k | C11 - 22uF | KILL_SWITCH | DC_BOOST | MOS_HS2 | MOS_LS2 | 5V_REG | 6V_REG
bPlace: R8 - 10 | C8 - 10nF | R4 - 50 | NAND_S2 | R9 - 10 OHM | C9 - 10 nF | R2 - 8.2k | R1 - 39k | C1 - 33nF | C13 - .47uF | C10 - .47uF | C7 - 22uF | C14 - 22uF